# Altium schematic sheet main.SchDoc: ENEL471 - Go Cart Controller Circuit
size A3; DrawnBy: Hassan Alhujhoj; Address1: ECE Department; Address2: University of Canterbury; Address3: Christchurch 8041; Address4: New Zealand
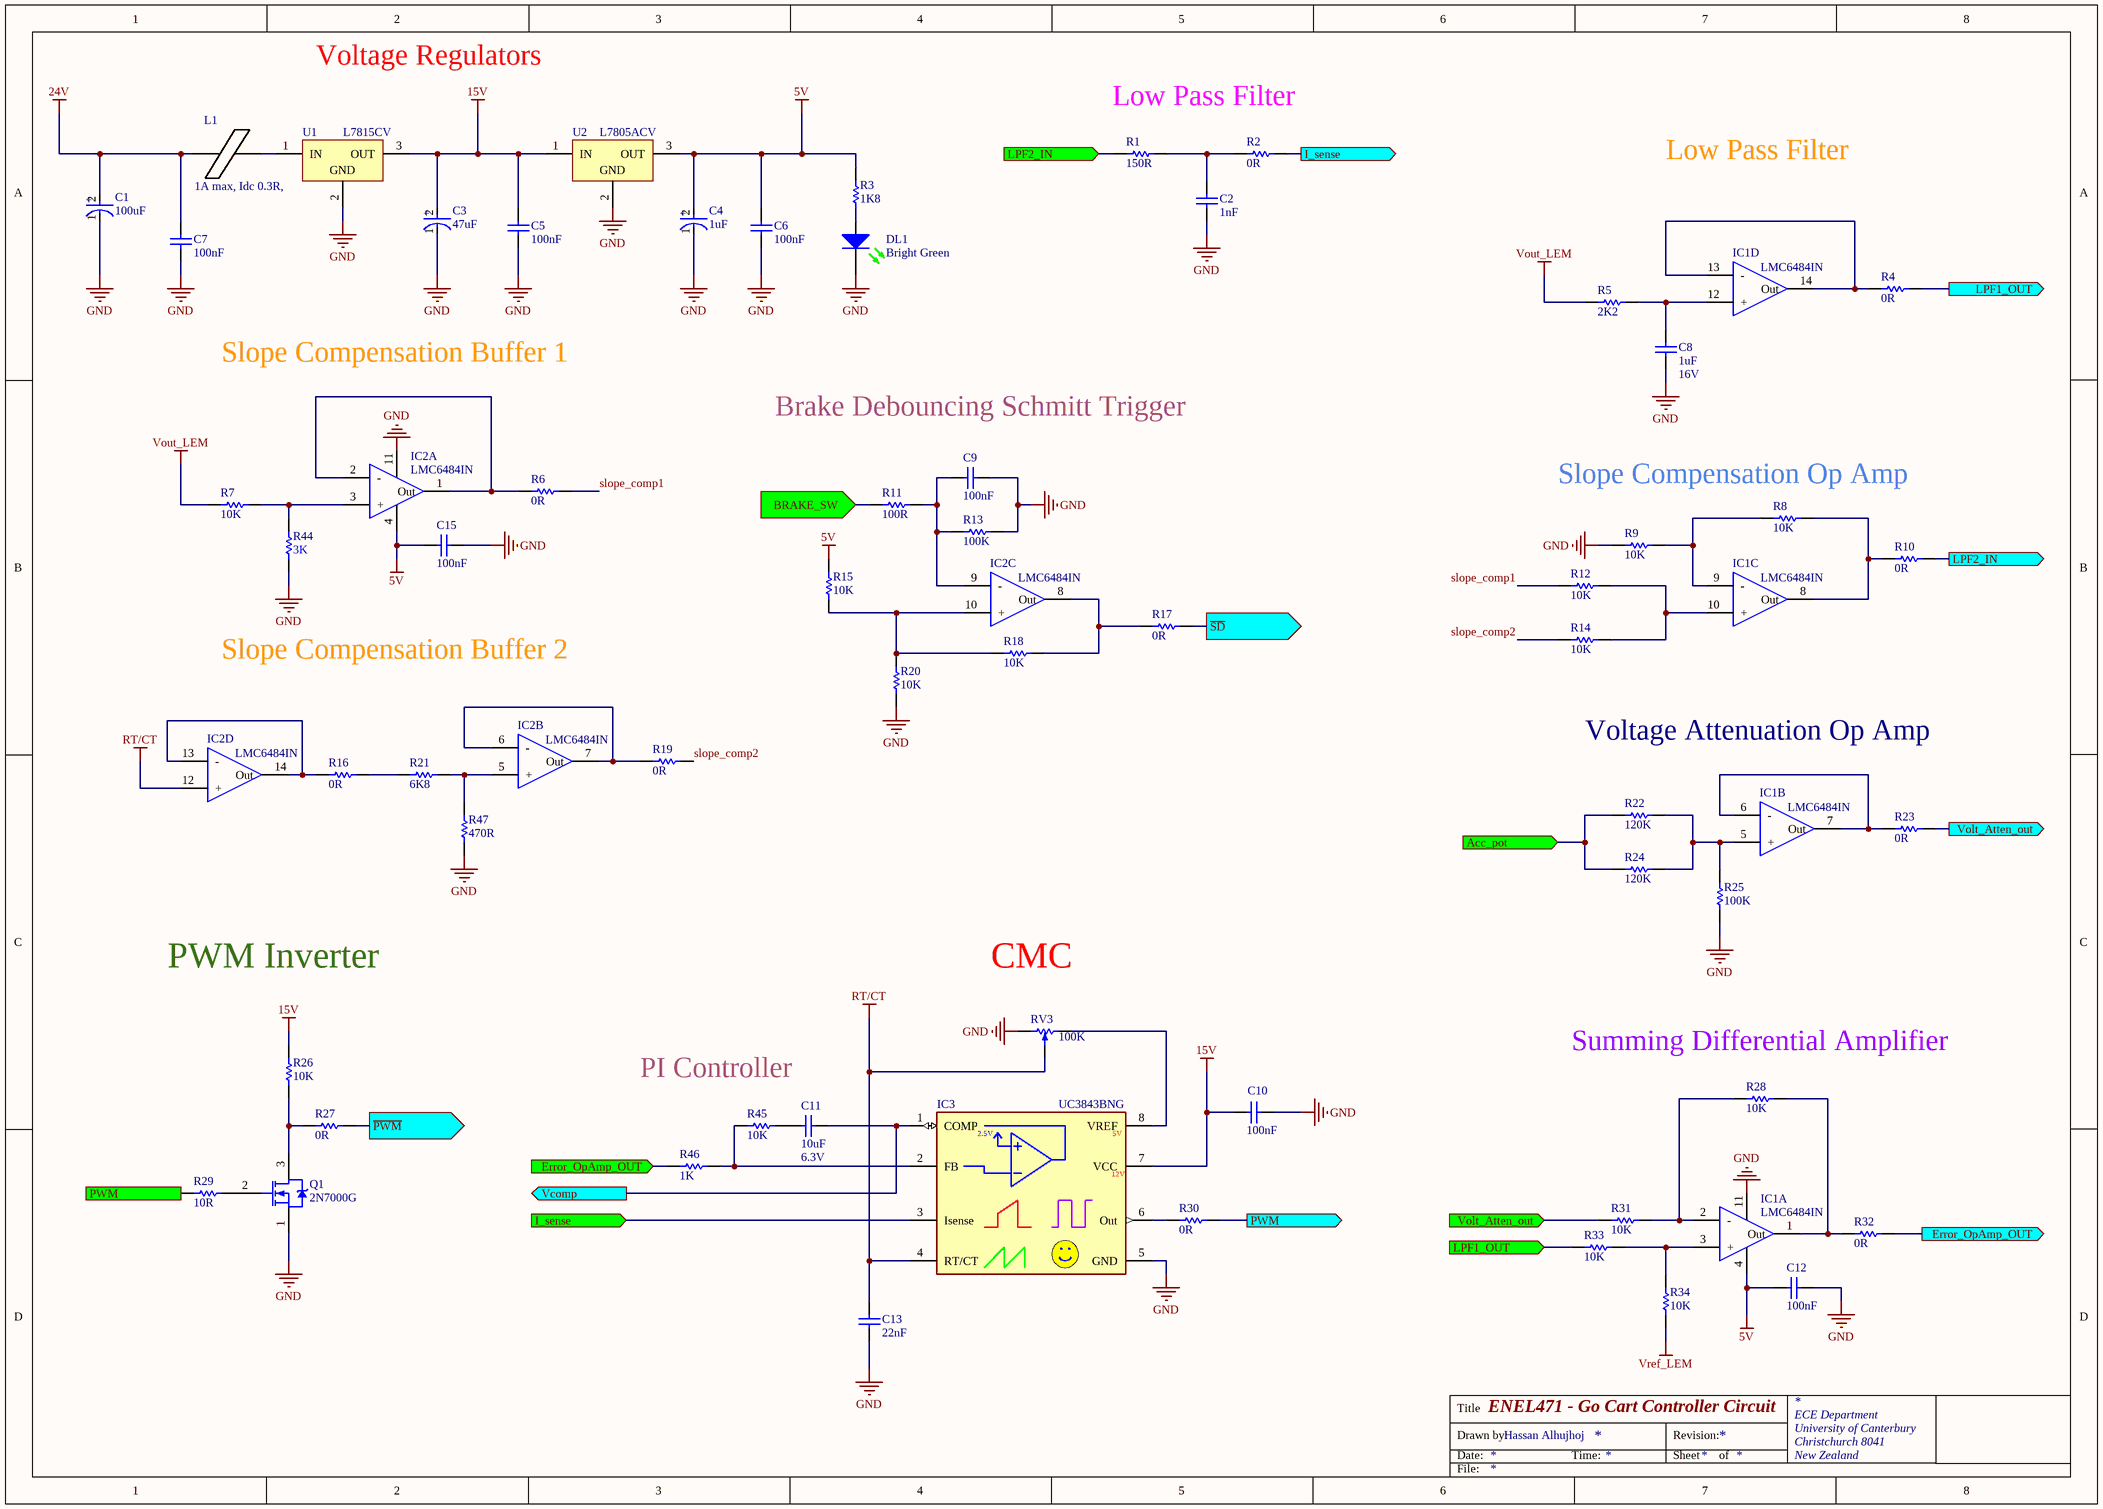
[diagram p0: main.SchDoc]

## Parts
C1  100uF  [FP-ESLGM-MFG]
C2  1nF  [CAPC1608L]
C3  47uF  [FP-ESLE3-MFG]
C4  1uF  [FP-UPW1E220MDD-MFG]
C5  100nF  [CAPC1608L]
C6  100nF  [CAPC1608L]
C7  100nF  [CAPC1608L]
C8  Max Voltage: 16V  [CAPC1608L]  (hidden comment: 1uF)
C9  100nF  [CAPC1608L]
C10  100nF  [CAPC1608L]
C11  Voltage - Rated: 6.3V  [CAPC1608L]  (hidden comment: 10uF)
C12  100nF  [CAPC1608L]
C13  22nF  [CAPC1608L]
C15  100nF  [CAPC1608L]
DL1  Bright Green  [WL-SMCW0603]
IC1  LMC6484IN  [DIP794W56P254L1905H533Q14N]  (parts A,B,C,D of 4)
IC2  LMC6484IN  [DIP794W56P254L1905H533Q14N]  (parts A,B,C,D of 4)
IC3  UC3843BNG  [DIP794W56P254L959H533Q8B]
L1  1A max, Idc 0.3R,  [INDC3216L]
Q1  2N7000G  [ONSC-TO-92-3-29-11]
R1  150R  [RESC1608L]
R2  0R  [RESC1608L]
R3  1K8  [RESC1608L]
R4  0R  [RESC1608L]
R5  2K2  [RESC1608L]
R6  0R  [RESC1608L]
R7  10K  [RESC1608L]
R8  10K  [RESC1608L]
R9  10K  [RESC1608L]
R10  0R  [RESC1608L]
R11  100R  [RESC1608L]
R12  10K  [RESC1608L]
R13  100K  [RESC1608L]
R14  10K  [RESC1608L]
R15  10K  [RESC1608L]
R16  0R  [RESC1608L]
R17  0R  [RESC1608L]
R18  10K  [RESC1608L]
R19  0R  [RESC1608L]
R20  10K  [RESC1608L]
R21  6K8  [RESC1608L]
R22  120K  [RESC1608L]
R23  0R  [RESC1608L]
R24  120K  [RESC1608L]
R25  100K  [RESC1608L]
R26  10K  [RESC1608L]
R27  0R  [RESC1608L]
R28  10K  [RESC1608L]
R29  10R  [RESC1608L]
R30  0R  [RESC1608L]
R31  10K  [RESC1608L]
R32  0R  [RESC1608L]
R33  10K  [RESC1608L]
R34  10K  [RESC1608L]
R44  3K  [RESC1608L]
R45  10K  [RESC1608L]
R46  1K  [RESC1608L]
R47  470R  [RESC1608L]
RV3  100K  [PVZ2A]
U1  L7815CV  [TO220]
U2  L7805ACV  [TO220]

## Ports
Acc_pot (in), BRAKE_SW (in), Error_OpAmp_OUT (in), Error_OpAmp_OUT (out), I_sense (in), I_sense (out), LPF1_OUT (in), LPF1_OUT (out), LPF2_IN (in), LPF2_IN (out), PWM (in), PWM (out), Vcomp (out), Volt_Atten_out (in), Volt_Atten_out (out), ~{PWM} (out), ~{SD} (out)

## Nets
5V: C4.2(A) C6.1 C12.1 C15.1 IC1.4(Vcc) IC2.4(Vcc) R3.1 R15.2 U2.3(OUT)
15V: C3.2(A) C5.1 C10.1 IC3.7(VCC) R26.2 U1.3(OUT) U2.1(IN)
24V: C1.2(A) C7.1 L1.1
GND: C1.1(C) C2.1 C3.1(C) C4.1(C) C5.2 C6.2 C7.2 C8.1 C9.2 C10.2 C12.2 C13.2 C15.2 DL1.1(K) IC1.11(-Vcc) IC2.11(-Vcc) IC3.5(GND) Q1.1(S) R9.1 R13.2 R20.1 R25.1 R44.1 R47.1 RV3.3(-) U1.2(GND) U2.2(GND)
RT/CT: C13.1 IC2.12(+) IC3.4(RT/CT) RV3.2(W)
Vout_LEM: R5.2 R7.1
Vref_LEM: R34.1
Acc_pot: R22.2 R24.1 ; port Acc_pot
BRAKE_SW: R11.1 ; port BRAKE_SW
Error_OpAmp_OUT: R32.2 R46.1 ; port Error_OpAmp_OUT
I_sense: IC3.3(Isense) R2.2 ; port I_sense
LPF1_OUT: R4.2 R33.1 ; port LPF1_OUT
LPF2_IN: R1.1 R10.2 ; port LPF2_IN
~{PWM}: R27.2 ; port ~{PWM}
PWM: R29.1 R30.2 ; port PWM
~{SD}: R17.2 ; port ~{SD}
slope_comp1: R6.2 R12.1
slope_comp2: R14.1 R19.2
Vcomp: C11.1 IC3.1(COMP) ; port Vcomp
Volt_Atten_out: R23.2 R31.1 ; port Volt_Atten_out
NetC2_2: C2.2 R1.2 R2.1
NetC8_2: C8.2 IC1.12(+) R5.1
NetC9_1: C9.1 IC2.9(-) R11.2 R13.1
NetC11_2: C11.2 R45.2
NetDL1_2: DL1.2(A) R3.2
NetIC1_1: IC1.1(Out) R28.2 R32.1
NetIC1_2: IC1.2(-) R28.1 R31.2
NetIC1_3: IC1.3(+) R33.2 R34.2
NetIC1_5: IC1.5(+) R22.1 R24.2 R25.2
NetIC1_6: IC1.6(-) IC1.7(Out) R23.1
NetIC1_8: IC1.8(Out) R8.2 R10.1
NetIC1_9: IC1.9(-) R8.1 R9.2
NetIC1_10: IC1.10(+) R12.2 R14.2
NetIC1_13: IC1.13(-) IC1.14(Out) R4.1
NetIC2_1: IC2.1(Out) IC2.2(-) R6.1
NetIC2_3: IC2.3(+) R7.2 R44.2
NetIC2_5: IC2.5(+) R21.2 R47.2
NetIC2_6: IC2.6(-) IC2.7(Out) R19.1
NetIC2_8: IC2.8(Out) R17.1 R18.2
NetIC2_10: IC2.10(+) R15.1 R18.1 R20.2
NetIC2_13: IC2.13(-) IC2.14(Out) R16.1
NetIC3_2: IC3.2(FB) R45.1 R46.2
NetIC3_6: IC3.6(Out) R30.1
NetIC3_8: IC3.8(VREF) RV3.1
NetL1_2: L1.2 U1.1(IN)
NetQ1_2: Q1.2(G) R29.2
NetQ1_3: Q1.3(D) R26.1 R27.1
NetR16_2: R16.2 R21.1

## Notes on the sheet
- Voltage Regulators
- Low Pass Filter
- Slope Compensation Buffer 1
- Brake Debouncing Schmitt Trigger
- (near R8) Slope Compensation Op Amp
- Slope Compensation Buffer 2
- Voltage Attenuation Op Amp
- PWM Inverter
- CMC
- (near R28) Summing Differential Amplifier
- PI Controller
- Title
- Drawn by:
- Date:
- Time:
- Revision:
- Sheet
- of
- File:
- (in symbol CMP-03015-000004-1) +
- (in symbol CMP-03015-000005-1) +
- (in symbol CMP-12462-000010-1) +
- (in symbol UC3843BNG) 2.5V; 5V; 12V

## Library data of the parts
C1 = CMP-03015-000005-1: CAP ALUM 100UF 20% 50V THRU HOLE. Part Number: ESL107M050AGMAA. Dia: 8mm.; Manufacturer: KEMET; Esr: 0.12Ω; Ripple Current: 725mA; Life: 10000Hours; Leakage Current: 50uA; Dissipation Factor: 10%; Material: Aluminum; Tolerance: 20%; Temperature Range High: +105°C; Automotive: No; Value: 100uF; Device Class L2: Capacitors; Lead Free: Yes; Octopart: https://octopart.com/esl107m050agmaa-kemet-84758890; Height: 13.5mm; ComponentLink2Description: Datasheet; Capacitance: 100uF; Package: ESLGM; RoHS: TRUE; Digikey Description: CAP ALUM 100UF 20% 50V THRU HOLE; Temperature Range Low: -40°C; Manufacturer Part Number: ESL107M050AGMAA; Device Class L1: Passive Components; Device Class L3: Aluminum Electrolytic Capacitors; Voltage Rating: 50V; Temperature: -40°C to +105°C; Category: Cap; ComponentLink2URL: https://content.kemet.com/datasheets/KEM_A4074_ESL.pdf
C2 = CC_1nF_0603: CAP CER 1nF X7R +-10% 50V 0603; PackageReference: 0603; Code_IPC: 1608 [0603]; Verify: *; Supplier: ECE Dept; Storage Location: PCB Assembly WS; Value: 1nF
C3 = CMP-03015-000004-1: CAP ALUM 10UF 20% 100V THRU HOLE. Part Number: ESL106M100AE3AA. Dia: 6.3mm.; Manufacturer: kemet; Life: 10000Hours; Ripple Current: 280mA; Dissipation Factor: 9%; Esr: 0.68Ω; Leakage Current: 10uA; Material: Aluminum; Tolerance: 20%; Voltage Rating: 100V; Device Class L3: Aluminum Electrolytic Capacitors; Value: 10uF; Height: 12.5mm; Temperature Range High: +105°C; Capacitance: 10uF; Manufacturer Part Number: ESL106M100AE3AA; ComponentLink2Description: Datasheet; Mouser Description: Cap, 10UF, 100V, Alu Elec, Radial; Category: Cap; Octopart: https://octopart.com/esl106m100ae3aa-kemet-84758885; Temperature: -40°C to +105°C; RoHS: TRUE; Device Class L1: Passive Components; Digikey Description: CAP ALUM 10UF 20% 100V THRU HOLE; ComponentLink2URL: https://content.kemet.com/datasheets/KEM_A4074_ESL.pdf; Device Class L2: Capacitors; Temperature Range Low: -40°C; Package: ESLE3; Automotive: No; Lead Free: Yes
C4 = CMP-12462-000010-1: CAP ALUM 22UF 20% 25V RADIAL. Part Number: UPW1E220MDD. Dia: 5mm.; Manufacturer: Nichicon; Leakage Current: 16.5uA; Ripple Current: 180mA; Life: 2000Hours; Dissipation Factor: 14%; Automotive Grade: Grade 2; Material: Aluminum; Voltage Rating: 25V; Device Class L1: Passive Components; ComponentLink2URL: https://products.nichicon.co.jp/en/pdf/XJA043/e-upw.pdf; Octopart: https://octopart.com/upw1e220mdd-nichicon-202818; RoHS: TRUE; Tolerance: 20%; Height: 12.5mm; Lead Free: Yes; Value: 22uF; Category: Cap; Temperature Range Low: -55°C; Device Class L3: Aluminum Electrolytic Capacitors; Package: 0; Manufacturer Part Number: UPW1E220MDD; Capacitance: 22uF; Automotive: Yes; Digikey Description: CAP ALUM 22UF 20% 25V RADIAL; Temperature: -55°C to +105°C; Device Class L2: Capacitors; ComponentLink2Description: Datasheet; Temperature Range High: +105°C
C5-C7 C9 C10 C12 C15 = CC_100nF_0603: CAP CER 100nF X7R +-10% 50V 0603; PackageReference: 0603; Code_IPC: 1608 [0603]; Verify: *; Supplier: ECE Dept; Storage Location: PCB Assembly WS; Value: 100nF
C8 = CC_1uF_0603: CAP CER 1uF Y5V -20% +80% 16V 0603; PackageReference: 0603; Code_IPC: 1608 [0603]; Verify: *; Supplier: ECE Dept; Storage Location: PCB Assembly WS; Value: 1uF
C11 = CC_10uF_0603: CAP CER 10UF X5R +-20% 6V3 0603; Supplier: ECE Dept; Storage Location: PCB Assembly WS; Value: 10uF
C13 = CC_22nF_0603: CAP CER 22nF X7R +-10% 50V 0603; PackageReference: 0603; Code_IPC: 1608 [0603]; Verify: *; Supplier: ECE Dept; Storage Location: PCB Assembly WS; Value: 22nF
DL1 = DL_150060VS75000: LED Bright Green 40mcd 0603 SMD; Manufacturer: WURTH ELEKTRONIK; Forward Current If: 30; Forward Voltage: 2; Viewing Angle: 140°; Wavelength Typ: 570; Luminous Intensity: 40; LED Mounting: SMD; Supplier 1: Farnell; Supplier Part Number 1: 2322073; Manufacturer Part Number: 150060VS75000; Storage Location: PCB Assembly WS; Supplier: ECE Dept; LED Colour: Bright Green
IC1 IC2 = LMC6484IN: Integrated Circuit; Manufacturer_Name: Texas Instruments; Datasheet Link: http://www.ti.com/lit/gpn/lmc6484; Height: 5.334mm; Manufacturer_Part_Number: LMC6484IN; Arrow Part Number: LMC6484IN; Mouser Part Number: 926-LMC6484IN; Mouser Price/Stock: https://www.mouser.com/Search/Refine.aspx?Keyword=926-LMC6484IN
IC3 = UC3843BNG: Integrated Circuit; Manufacturer_Name: ON Semiconductor; Datasheet Link: http://www.onsemi.com/pub/Collateral/UC3842B-D.PDF; Height: 5.33mm; Manufacturer_Part_Number: UC3843BNG; Arrow Part Number: UC3843BNG; Arrow Price/Stock: https://www.arrow.com/en/products/uc3843bng/on-semiconductor; Mouser Part Number: 863-UC3843BNG; Mouser Price/Stock: https://www.mouser.co.uk/ProductDetail/ON-Semiconductor/UC3843BNG?qs=xZq1yRCsb1c8CkSt0UbHMA%3D%3D
L1 = IN_Ferrite-Bead: Ferrite Bead, Rdc 0.3R, Z100MHZ 600R, Imax 1A, SMD 1206; Manufacturer: FAIR-RITE; Manufacturer PN: 2512066017Y1; DC Current Rating: 1; DC Resistance Max: 0.08; Ferrite Case Style: 1206 ^3216 Metric]; Frequency Range: 50MHz to 1; Impedance: 600; Impedance Tolerance: ± 25%; Supplier: ECE Dept; Storage Location: PCB Assembly WS; Ferrite Mounting: SMD; Supplier 1: Farnell; Supplier Part Number 1: 1612060; Manufacturer Part Number: 2512066017Y1; Value: 1A max, Idc 0.3R,
Q1 = CMP-1058-00937-1: Small Signal MOSFET, 200 mA, 60 V, N-Channel, 3-Pin TO-92, Pb-Free, Bulk Box; Manufacturer: On Semiconductor; Coss Typ (pF): 25; ID Max (A): 0.2; Ciss Typ (pF): 60; VGS(th) Max (V): 3; PD Max (W): 0.35; Configuration: Single; Channel Polarity: N Channel; VGS Max (V): 20; Crss Typ (pF): 5; RoHS: Pb-Free; PackageVersion: Rev. AM; Mounting Technology: Through Hole; PackageReference: TO-92-3-29-11_AM_SL; ComponentLink1Description: Manufacturer URL; PartNumber: 2N7000G; Package Type: TO-92; ComponentLink3Description: Package Specification; ComponentLink2Description: Datasheet; ComponentLink3URL: http://www.onsemi.cn/pub_link/Collateral/2N6426-D.PDF; DatasheetVersion: Rev. 8; Packing: Bulk Box; PackageDescription: 3-Pin Transistor Outline, Body 4.825 x 3.685 mm, Pitch 1.27 mm; ComponentLink1URL: http://www.onsemi.com/; V(BR)DSS Min (V): 60; ComponentLink2URL: http://www.onsemi.com/pub_link/Collateral/2N7000-D.PDF
R1 = RS_150R: RES 150 OHM 1/10W 5% 0603 SMD; Storage Location: PCB Assembly WS; Supplier: ECE Dept; Value: 150R
R2 R4 R6 R10 R16 R17 R19 R23 R27 R30 R32 = RS_0R0: RES 0.0 OHM 1/10W 5% 0603 SMD; Storage Location: PCB Assembly WS; Supplier: ECE Dept; Value: 0R
R3 = RS_1K8: RES 1.8K OHM 1/10W 5% 0603 SMD; Storage Location: PCB Assembly WS; Supplier: ECE Dept; Value: 1K8
R5 = RS_2K2: RES 2.2K OHM 1/10W 5% 0603 SMD; Storage Location: PCB Assembly WS; Supplier: ECE Dept; Value: 2K2
R7-R9 R12 R14 R15 R18 R20 R26 R28 R31 R33 R34 R45 = RS_10K: RES 10.0K OHM 1/10W 5% 0603 SMD; Storage Location: PCB Assembly WS; Supplier: ECE Dept; Value: 10K
R11 = RS_100R: RES 100 OHM 1/10W 5% 0603 SMD; Storage Location: PCB Assembly WS; Supplier: ECE Dept; Value: 100R
R13 R25 = RS_100K: RES 100K OHM 1/10W 5% 0603 SMD; Storage Location: PCB Assembly WS; Supplier: ECE Dept; Value: 100K
R21 = RS_6K8: RES 6k8 OHM 1/10W 5% 0603 SMD; Storage Location: PCB Assembly WS; Supplier: ECE Dept; Value: 6K8
R22 R24 = RS_120K: RES 120K OHM 1/10W 5% 0603 SMD; Storage Location: PCB Assembly WS; Supplier: ECE Dept; Value: 120K
R29 = RS_10R: RES 10 OHM 1/10W 5% 0603 SMD; Storage Location: PCB Assembly WS; Supplier: ECE Dept; Value: 10R
R44 = RS_3K: RES 3K OHM 1/10W 5% 0603 SMD; Storage Location: PCB Assembly WS; Supplier: ECE Dept; Value: 3K
R46 = RS_1K: RES 1.0K OHM 1/10W 5% 0603 SMD; Storage Location: PCB Assembly WS; Supplier: ECE Dept; Value: 1K
R47 = RS_470R: RES 470 OHM 1/10W 5% 0603 SMD; Storage Location: PCB Assembly WS; Supplier: ECE Dept; Value: 470R
RV3 = RM_100K: Trim Pot SMD 100K Murata PVZ2 Series SMD; Manufacturer Part Number: PVZ2A104C04B00; Adjustment Type: Top; External Depth: 2.7; External Length / Height: 0.85; External Width: 2.1; No. of Turns: 1; Power Rating: 50; Resistor Element Material: Metal Foil; Manufacturer: MURATA; Storage Location: PCB Assembly WS; Potentiometer Mounting: SMD; Series: PVZ2; Supplier 1: Farnell; Supplier Part Number 1: 1771728; Supplier: ECE Dept; Value: 100K
U1 = CMP-0244-00422-1: Positive Voltage Regulator, 15V, 3-Pin TO-220; ComponentLink1Description: Manufacturer URL; ComponentLink3URL: http://www.st.com/internet/com/TECHNICAL_RESOURCES/TECHNICAL_LITERATURE/PACKAGE_INFORMATION/CD00004649.pdf; ComponentLink3Description: Package Specification; ComponentLink1URL: http://www.st.com; ComponentLink2Description: Datasheet; DatasheetVersion: 16/11/2011; ComponentLink2URL: http://www.st.com/internet/com/TECHNICAL_RESOURCES/TECHNICAL_LITERATURE/DATASHEET/CD00000444.pdf; PackageVersion: ver3.0; PackageDescription: TO, Thru-Hole, Vertical, Heatsink Mounted; 3 In-Line Leads; Pitch 2.54 mm; PackageReference: TO220
U2 = CMP-0244-00484-1: Positive Voltage Regulator, 5V, 3-Pin TO-220; DatasheetVersion: 16/11/2011; ComponentLink2Description: Datasheet; ComponentLink3Description: Package Specification; ComponentLink2URL: http://www.st.com/internet/com/TECHNICAL_RESOURCES/TECHNICAL_LITERATURE/DATASHEET/CD00000444.pdf; PackageDescription: TO, Thru-Hole, Vertical, Heatsink Mounted; 3 In-Line Leads; Pitch 2.54 mm; ComponentLink3URL: http://www.st.com/internet/com/TECHNICAL_RESOURCES/TECHNICAL_LITERATURE/PACKAGE_INFORMATION/CD00004649.pdf; PackageReference: TO220; ComponentLink1URL: http://www.st.com; PackageVersion: ver3.0; ComponentLink1Description: Manufacturer URL